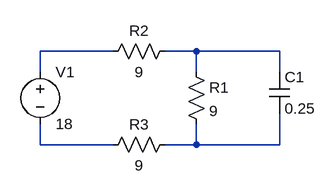
[diagram p0: schematic 19thoct(circuit4).asc]
19thoct(circuit4).asc, the LTspice schematic file:
Version 4
SHEET 1 880 680
WIRE 144 96 32 96
WIRE 272 96 224 96
WIRE 400 96 272 96
WIRE 32 128 32 96
WIRE 272 128 272 96
WIRE 400 128 400 96
WIRE 32 240 32 208
WIRE 144 240 32 240
WIRE 272 240 272 208
WIRE 272 240 224 240
WIRE 400 240 400 192
WIRE 400 240 272 240
SYMBOL voltage 32 112 R0
WINDOW 123 0 0 Left 0
WINDOW 39 0 0 Left 0
SYMATTR InstName V1
SYMATTR Value 18
SYMBOL res 256 112 R0
SYMATTR InstName R1
SYMATTR Value 9
SYMBOL res 240 80 R90
WINDOW 0 0 56 VBottom 2
WINDOW 3 32 56 VTop 2
SYMATTR InstName R2
SYMATTR Value 9
SYMBOL res 240 224 R90
WINDOW 0 0 56 VBottom 2
WINDOW 3 32 56 VTop 2
SYMATTR InstName R3
SYMATTR Value 9
SYMBOL cap 384 128 R0
SYMATTR InstName C1
SYMATTR Value 0.25

The netlist it stands for:
* 19thoct(circuit4).asc
V1 N001 N003 18
R1 N002 N004 9
R2 N002 N001 9
R3 N004 N003 9
C1 N002 N004 0.25
.backanno
.end